# EAGLE schematic OrmerodController (EAGLE 7.2.0)
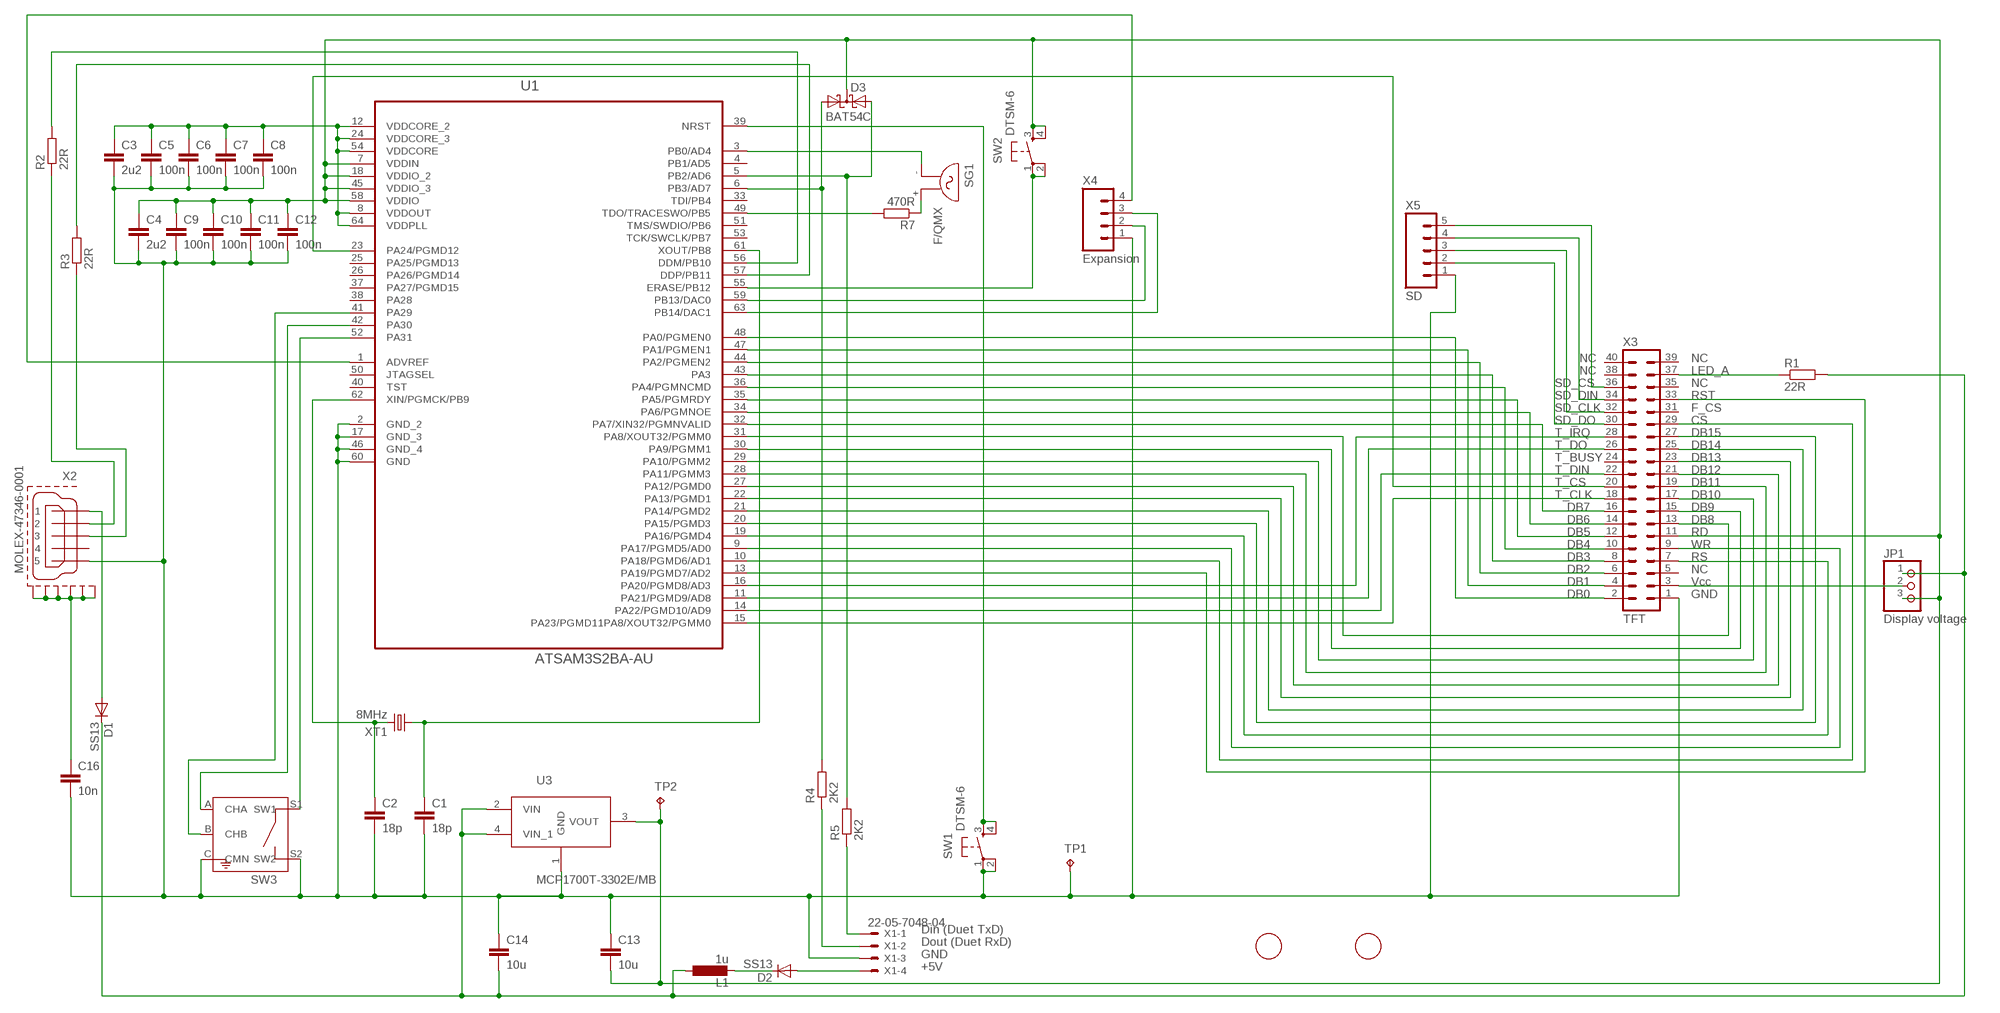
[diagram p0: schematic, sheet 1]

## Parts
C1  18p  C-EUC0603  [C0603]
C2  18p  C-EUC0603  [C0603]
C3  2u2  C-EUC0603  [C0603]
C4  2u2  C-EUC0603  [C0603]
C5  100n  C-EUC0603  [C0603]
C6  100n  C-EUC0603  [C0603]
C7  100n  C-EUC0603  [C0603]
C8  100n  C-EUC0603  [C0603]
C9  100n  C-EUC0603  [C0603]
C10  100n  C-EUC0603  [C0603]
C11  100n  C-EUC0603  [C0603]
C12  100n  C-EUC0603  [C0603]
C13  10u  C-EUC0805  [C0805]
C14  10u  C-EUC0805  [C0805]
C16  10n  C-EUC0603  [C0603]
D1  SS13  DIODE-DO214AC  [DO214AC]
D2  SS13  DIODE-DO214AC  [DO214AC]
D3  BAT54C  [SOT23]
JP1  Display voltage  PINHD-1X3  [1X03]
L1  1u  L-EUL2012C  [L2012C]
R1  22R  R-EU_R0805  [R0805]
R2  22R  R-EU_R0603  [R0603]
R3  22R  R-EU_R0603  [R0603]
R4  2K2  R-EU_R0603  [R0603]
R5  2K2  R-EU_R0603  [R0603]
R7  470R  R-EU_R0603  [R0603]
SG1  F/QMX  [F/QMX]
SW1  DTSM-6  [DTSM-6]
SW2  DTSM-6  [DTSM-6]
SW3  PEC12_ENCODER  [PEC12_ENCODER]
TP1  TPPAD1-10  [P1-10]
TP2  TPPAD1-10  [P1-10]
U1  ATSAM3S2BA-AU  [QFP50P1200X1200X160-64N]
U3  MCP1700T-3302E/MB  MCP17-MCP1702T-3302E/MB  [SOT150P400X160-4N]
U$1  FIDUCIAL  [FIDUCIAL_1MM]
U$2  FIDUCIAL  [FIDUCIAL_1MM]
X1  22-05-7048-04  [7395-04]
X2  MOLEX-47346-0001  [MOLEX-47364-0001]
X3  TFT  MA20-2  [MA20-2]
X4  Expansion  M04PTH  [1X04]
X5  SD  M05PTH  [1X05]
XT1  8MHz  CRYSTALHC49U-V  [HC49U-V]

## Nets
GND: C1.2 C2.2 C3.2 C4.2 C5.2 C6.2 C7.2 C8.2 C9.2 C10.2 C11.2 C12.2 C13.1 C14.1 C16.2 SW1.1 SW1.2 SW3.C(CMN) SW3.S2(SW2) TP1.TP U1.2(GND_2) U1.17(GND_3) U1.46(GND_4) U1.60(GND) U3.1(GND) X1.3 X2.5 X3.1 X4.1 X5.1
N$1: U1.48(PA0/PGMEN0) X3.2
N$2: U1.15(PA23/PGMD11PA8/XOUT32/PGMM0) X3.18
N$3: U1.47(PA1/PGMEN1) X3.4
N$4: U1.44(PA2/PGMEN2) X3.6
N$5: U1.36(PA4/PGMNCMD) X3.10
N$6: U1.34(PA6/PGMNOE) X3.14
N$7: U1.35(PA5/PGMRDY) X3.12
N$8: U1.32(PA7/XIN32/PGMNVALID) X3.16
N$9: U1.31(PA8/XOUT32/PGMM0) X3.13
N$10: U1.43(PA3) X3.8
N$11: U1.30(PA9/PGMM1) X3.15
N$12: U1.29(PA10/PGMM2) X3.17
N$13: U1.28(PA11/PGMM3) X3.19
N$14: U1.27(PA12/PGMD0) X3.21
N$15: U1.22(PA13/PGMD1) X3.23
N$16: U1.21(PA14/PGMD2) X3.25
N$17: U1.20(PA15/PGMD3) X3.27
N$18: R2.2 U1.56(DDM/PB10)
N$19: U1.14(PA22/PGMD10/AD9) X3.22
N$20: U1.11(PA21/PGMD9/AD8) X3.26
N$21: C1.1 U1.61(XOUT/PB8) XT1.1
N$22: C2.1 U1.62(XIN/PGMCK/PB9) XT1.2
N$23: SW2.1 SW2.2 U1.55(ERASE/PB12)
N$24: SW3.B(CHB) U1.41(PA29)
N$25: SW1.3 SW1.4 U1.39(NRST)
N$26: D3.2(A2) R5.2 U1.5(PB2/AD6)
N$27: D3.1(A1) R4.2 U1.6(PB3/AD7)
N$28: R3.2 U1.57(DDP/PB11)
N$29: R4.1 X1.2
N$30: R5.1 X1.1
N$31: D1.A X2.1
N$32: R2.1 X2.2
N$33: SG1.- U1.3(PB0/AD4)
N$34: R3.1 X2.3
N$35: U1.23(PA24/PGMD12) X3.20
N$36: U1.16(PA20/PGMD8/AD3) X3.28
N$37: JP1.2 X3.3
N$38: R1.1 X3.37
N$39: X3.36 X5.5
N$40: U1.63(PB14/DAC1) X4.3
N$41: SW3.A(CHA) U1.42(PA30)
N$42: SW3.S1(SW1) U1.52(PA31)
N$43: U1.13(PA19/PGMD7/AD2) X3.33
N$44: U1.10(PA18/PGMD6/AD1) X3.29
N$45: U1.9(PA17/PGMD5/AD0) X3.9
N$46: D2.C L1.2
N$47: C16.1 X2.GND1 X2.GND2 X2.GND3 X2.GND4 X2.GND5 X2.GND6
N$48: U1.19(PA16/PGMD4) X3.7
N$49: U1.59(PB13/DAC0) X4.2
N$50: D2.A X1.4
N$51: X3.34 X5.4
N$52: R7.1 SG1.+
N$53: U1.1(ADVREF) X4.4
N$54: R7.2 U1.49(TDO/TRACESWO/PB5)
N$55: C3.1 C5.1 C6.1 C7.1 C8.1 U1.8(VDDOUT) U1.12(VDDCORE_2) U1.24(VDDCORE_3) U1.54(VDDCORE) U1.64(VDDPLL)
N$56: X3.32 X5.3
N$57: X3.30 X5.2
VCC: C4.1 C9.1 C10.1 C11.1 C12.1 C13.2 D3.3(CC) JP1.3 SW2.3 SW2.4 TP2.TP U1.7(VDDIN) U1.18(VDDIO_2) U1.45(VDDIO_3) U1.58(VDDIO) U3.3(VOUT) X3.11
VCC5: C14.2 D1.C JP1.1 L1.1 R1.2 U3.2(VIN) U3.4(VIN_1)
Unconnected: U1.4(PB1/AD5) U1.25(PA25/PGMD13) U1.26(PA26/PGMD14) U1.33(TDI/PB4) U1.37(PA27/PGMD15) U1.38(PA28) U1.40(TST) U1.50(JTAGSEL) U1.51(TMS/SWDIO/PB6) U1.53(TCK/SWCLK/PB7) X2.4 X3.5 X3.24 X3.31 X3.35 X3.38 X3.39 X3.40

## Notes on the sheet
- NC | NC
- NC | LED_A
- SD_CS | NC
- SD_DIN | RST
- SD_CLK | F_CS
- SD_DO | CS
- T_IRQ | DB15
- T_DO | DB14
- T_BUSY | DB13
- T_DIN | DB12
- T_CS | DB11
- T_CLK | DB10
- DB7 | DB9
- DB6 | DB8
- DB5 | RD
- DB4 | WR
- DB3 | RS
- DB2 | NC
- DB1 | Vcc
- DB0 | GND
- Din (Duet TxD)
- Dout (Duet RxD)
- GND
- +5V

## Library data of the parts
C1-C14 C16 = resistor:C-EU: CAPACITOR, European symbol
D1 D2 = diode:DIODE-: DIODE
D3 = diode:BAT54C: Schottky Diodes Source: Fairchild .. BAT54.pdf
JP1 = adafruit:PINHD-1X3: PIN HEADER
L1 = resistor:L-EU: INDUCTOR, European symbol
R1-R5 R7 = resistor:R-EU_: RESISTOR, European symbol
SG1 = buzzer:F/QMX: BUZZER Source: Buerklin; OC_FARNELL: unknown; OC_NEWARK: unknown
SW1 SW2 = switch-tact:DTSM-6
SW3 = carrilib:PEC12_ENCODER: Encoder, 12-24 PPR /w Momentary Switch Manufacturer: Bourns Part Number: PEC12-4020F-S00?? (No Detents) PEC12-4120F-S00?? (12 Detents) PEC12-4220F-S00?? (24 Detents)
TP1 TP2 = testpad:TP: Test pad
U1 = Atmel_By_element14_Batch_1-00:ATSAM3S2BA-AU: Flash MCU; DESCRIPTION: Flash MCU; MPN: ATSAM3S2BA-AU; OC_FARNELL: 1841653; OC_NEWARK: 12T1311; PACKAGE: QFP-64; SUPPLIER: Atmel
U3 = Microchip-MCP170xxxx_MB:MCP17: Low Quiescent Current LDO Regulator; MPN: MCP1702T-3302E/MB; OC_FARNELL: 1605558; OC_NEWARK: 11N7989; PACKAGE: SOT89-3; SUPPLIER: Microchip
U$1 U$2 = adafruit:FIDUCIAL: For use by pick and place machines to calibrate the vision/machine, 1mm By microbuilder.eu
X1 = con-molex:22-?-04: CONNECTOR wire to board 2.54 mm (.1 inch) pitch header; OC_FARNELL: unknown; OC_NEWARK: unknown
X2 = usb_con-update:MOLEX-47346-0001: MICRO USB B, BOTTOM MOUNT
X3 = con-lstb:MA20-2: PIN HEADER; OC_FARNELL: unknown; OC_NEWARK: unknown
X4 = SparkFun-Connectors:M04: Header 4 Standard 4-pin 0.1" header. Use with straight break away headers (SKU : PRT-00116), right angle break away headers (PRT-00553), swiss pins (PRT-00743), machine pins (PRT-00117), and female headers (PRT-00115). Molex polarized connector foot print use with SKU : PRT-08231 with associated crimp pins and housings. 1MM SMD Version SKU: PRT-10208
X5 = SparkFun-Connectors:M05: Header 5 Standard 5-pin 0.1" header. Use with straight break away headers (SKU : PRT-00116), right angle break away headers (PRT-00553), swiss pins (PRT-00743), machine pins (PRT-00117), and female headers (PRT-00115). Molex polarized connector foot print use with SKU : PRT-08230 with associated crimp pins and housings.
XT1 = crystal:CRYSTAL: CRYSTAL; OC_FARNELL: 1666969; OC_NEWARK: unknown